# Altium schematic sheet CAN.SchDoc
size A3; SheetNumber: 3; SheetTotal: 5
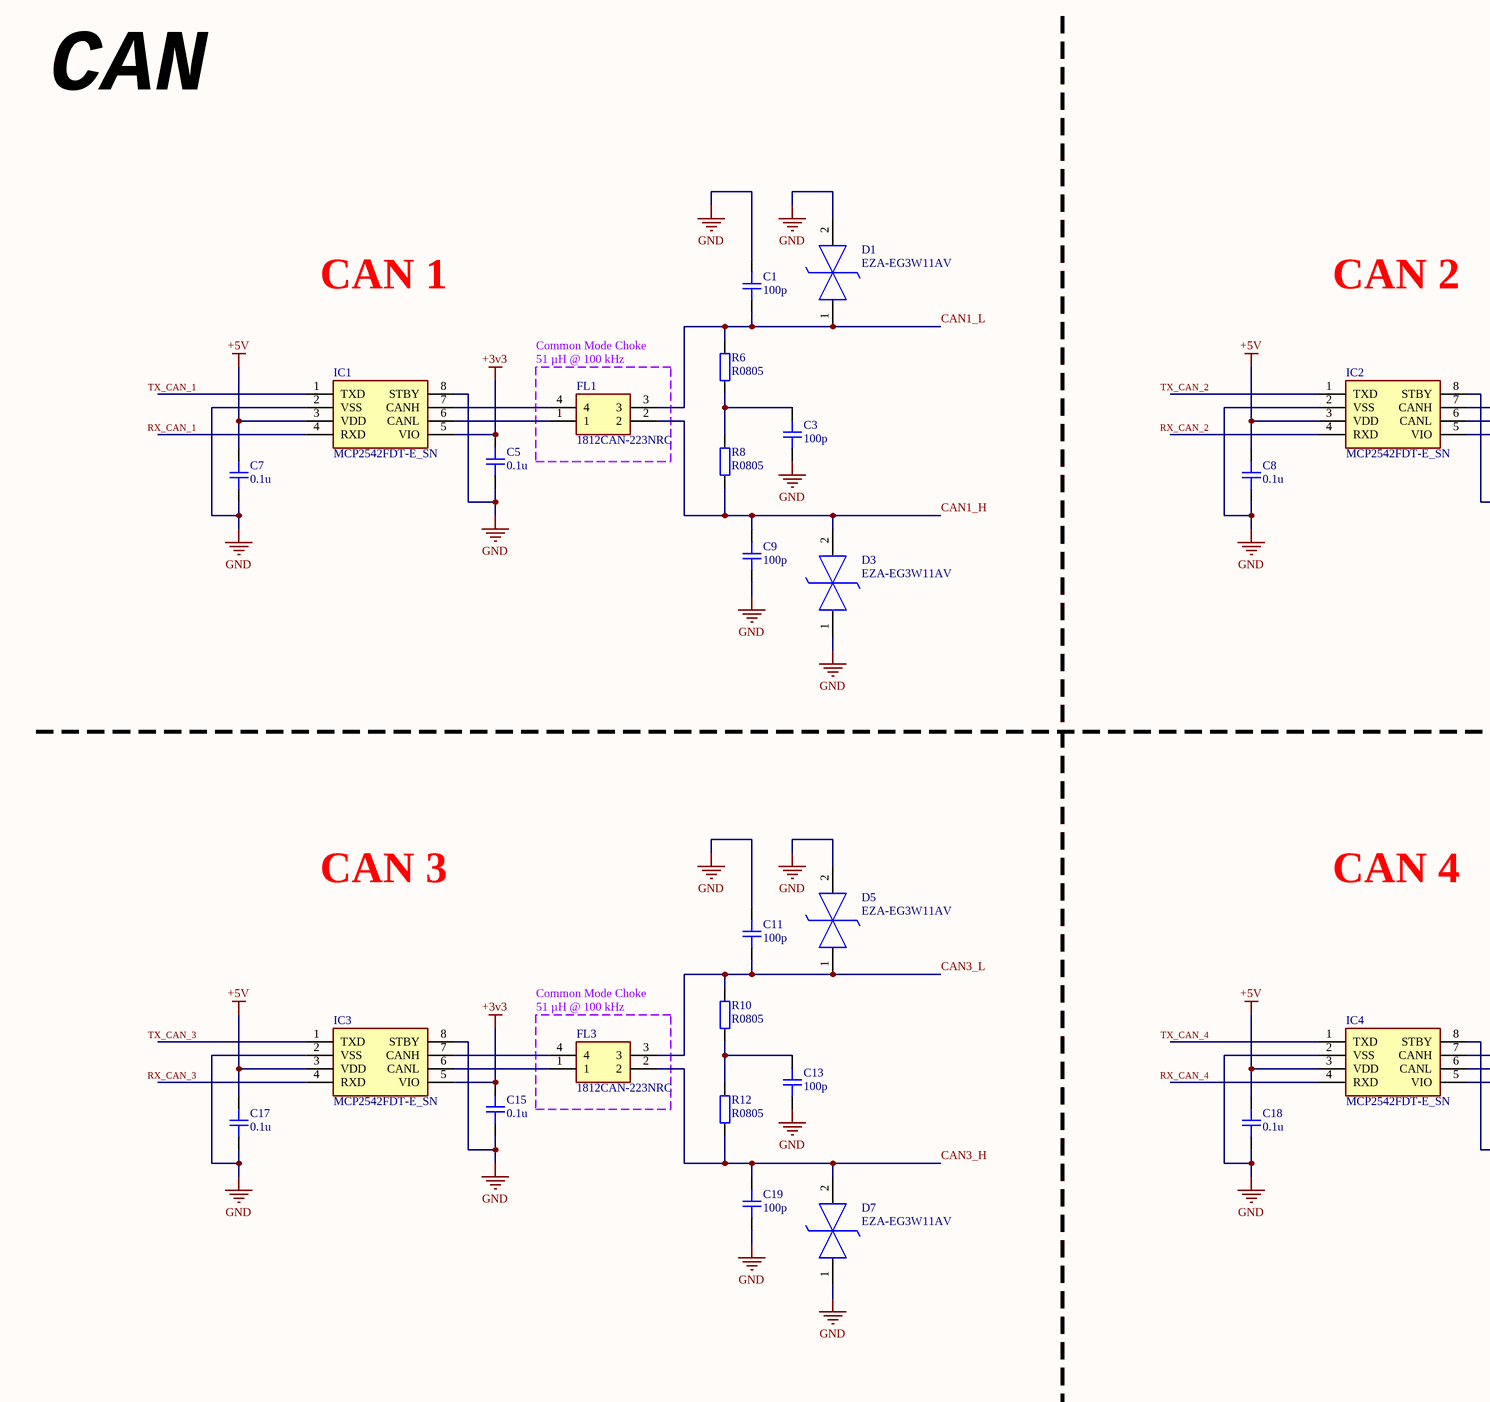
[diagram p0: CAN.SchDoc, left]
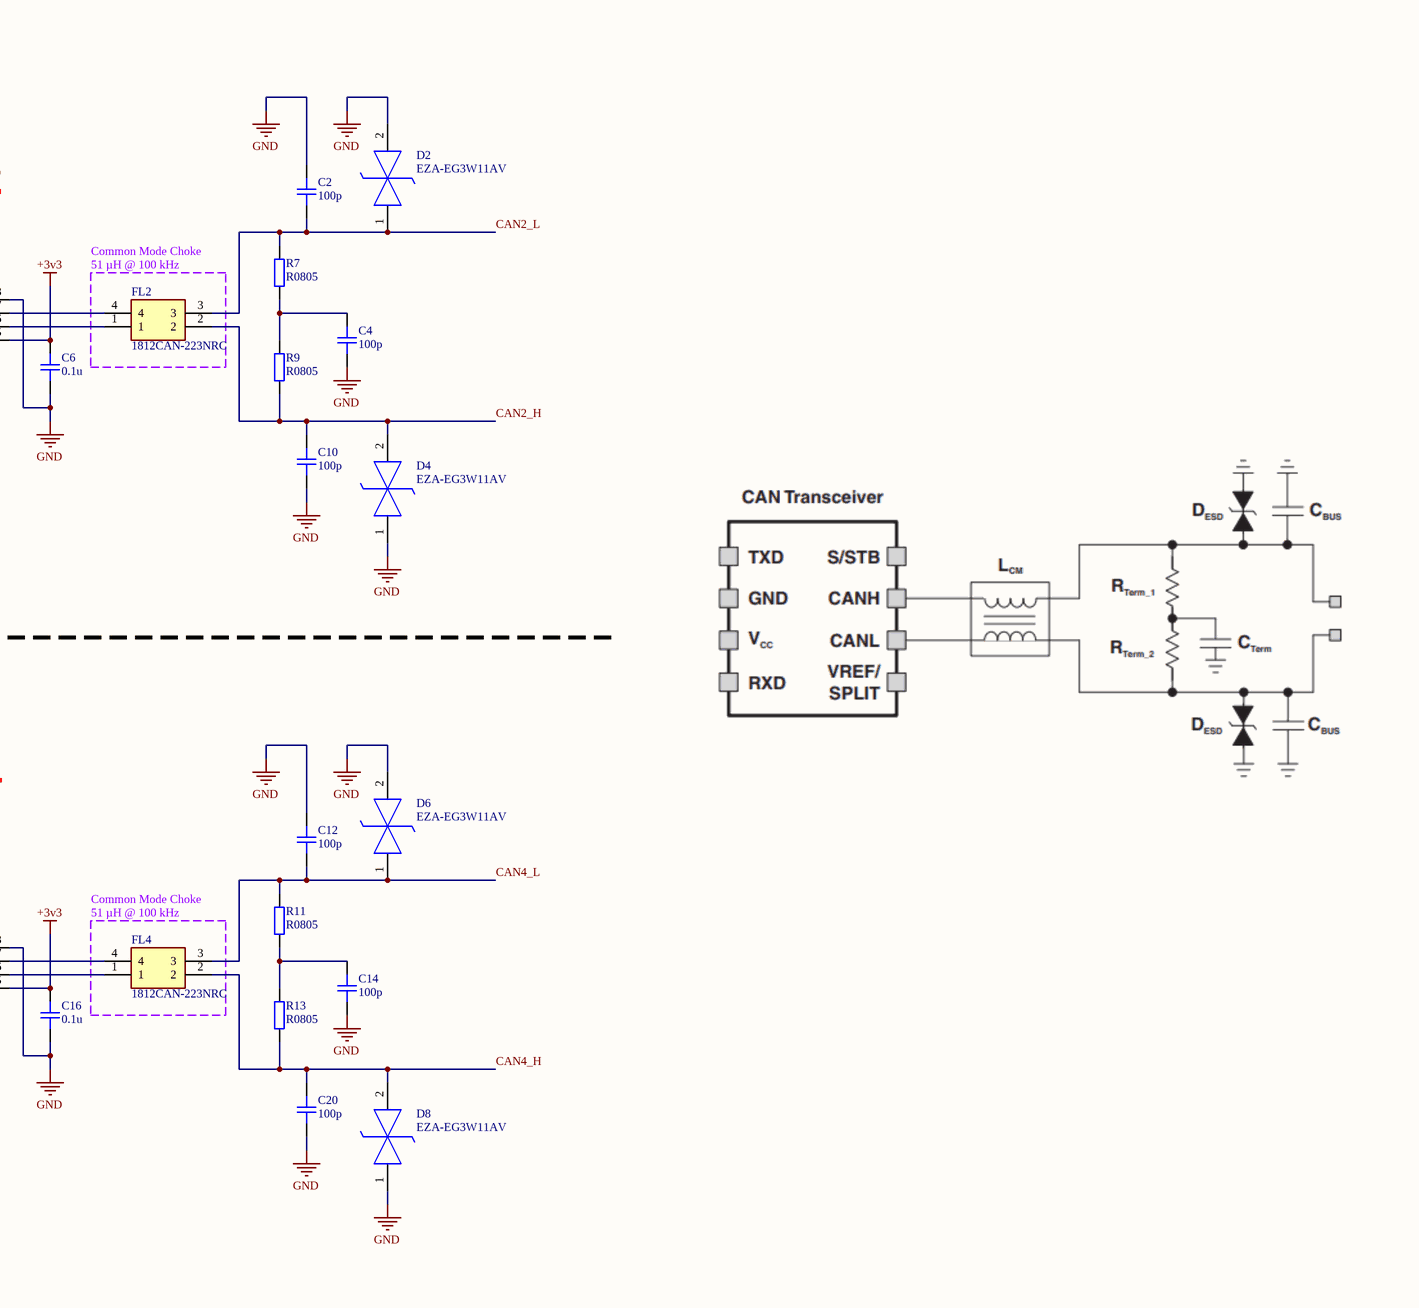
[diagram p1: CAN.SchDoc, right]

## Parts
C1  100p  [CAP_0805]
C2  100p  [CAP_0805]
C3  100p  [CAP_0805]
C4  100p  [CAP_0805]
C5  0.1u  [CAP_0805]
C6  0.1u  [CAP_0805]
C7  0.1u  [CAP_0805]
C8  0.1u  [CAP_0805]
C9  100p  [CAP_0805]
C10  100p  [CAP_0805]
C11  100p  [CAP_0805]
C12  100p  [CAP_0805]
C13  100p  [CAP_0805]
C14  100p  [CAP_0805]
C15  0.1u  [CAP_0805]
C16  0.1u  [CAP_0805]
C17  0.1u  [CAP_0805]
C18  0.1u  [CAP_0805]
C19  100p  [CAP_0805]
C20  100p  [CAP_0805]
D1  EZA-EG3W11AV  [EZAEG3W11AV]
D2  EZA-EG3W11AV  [EZAEG3W11AV]
D3  EZA-EG3W11AV  [EZAEG3W11AV]
D4  EZA-EG3W11AV  [EZAEG3W11AV]
D5  EZA-EG3W11AV  [EZAEG3W11AV]
D6  EZA-EG3W11AV  [EZAEG3W11AV]
D7  EZA-EG3W11AV  [EZAEG3W11AV]
D8  EZA-EG3W11AV  [EZAEG3W11AV]
FL1  1812CAN-223NRC  [1812CAN223NRC]
FL2  1812CAN-223NRC  [1812CAN223NRC]
FL3  1812CAN-223NRC  [1812CAN223NRC]
FL4  1812CAN-223NRC  [1812CAN223NRC]
IC1  MCP2542FDT-E_SN  [SOIC127P600X175-8N]
IC2  MCP2542FDT-E_SN  [SOIC127P600X175-8N]
IC3  MCP2542FDT-E_SN  [SOIC127P600X175-8N]
IC4  MCP2542FDT-E_SN  [SOIC127P600X175-8N]
R6  R0805  [RES_0805]
R7  R0805  [RES_0805]
R8  R0805  [RES_0805]
R9  R0805  [RES_0805]
R10  R0805  [RES_0805]
R11  R0805  [RES_0805]
R12  R0805  [RES_0805]
R13  R0805  [RES_0805]

## Nets
+3v3: C5.2 C6.2 C15.2 C16.2 IC1.5(VIO) IC2.5(VIO) IC3.5(VIO) IC4.5(VIO)
+5V: C7.2 C8.2 C17.2 C18.2 IC1.3(VDD) IC2.3(VDD) IC3.3(VDD) IC4.3(VDD)
GND: C1.1 C2.1 C3.2 C4.2 C5.1 C6.1 C7.1 C8.1 C9.2 C10.2 C11.1 C12.1 C13.2 C14.2 C15.1 C16.1 C17.1 C18.1 C19.2 C20.2 D1.2(K2) D2.2(K2) D3.1(K1) D4.1(K1) D5.2(K2) D6.2(K2) D7.1(K1) D8.1(K1) IC1.2(VSS) IC1.8(STBY) IC2.2(VSS) IC2.8(STBY) IC3.2(VSS) IC3.8(STBY) IC4.2(VSS) IC4.8(STBY)
CAN1_H: C9.1 D3.2(K2) FL1.2 R8.1
CAN1_L: C1.2 D1.1(K1) FL1.3 R6.2
CAN2_H: C10.1 D4.2(K2) FL2.2 R9.1
CAN2_L: C2.2 D2.1(K1) FL2.3 R7.2
CAN3_H: C19.1 D7.2(K2) FL3.2 R12.1
CAN3_L: C11.2 D5.1(K1) FL3.3 R10.2
CAN4_H: C20.1 D8.2(K2) FL4.2 R13.1
CAN4_L: C12.2 D6.1(K1) FL4.3 R11.2
RX_CAN_1: IC1.4(RXD)
RX_CAN_2: IC2.4(RXD)
RX_CAN_3: IC3.4(RXD)
RX_CAN_4: IC4.4(RXD)
TX_CAN_1: IC1.1(TXD)
TX_CAN_2: IC2.1(TXD)
TX_CAN_3: IC3.1(TXD)
TX_CAN_4: IC4.1(TXD)
NetC3_1: C3.1 R6.1 R8.2
NetC4_1: C4.1 R7.1 R9.2
NetC13_1: C13.1 R10.1 R12.2
NetC14_1: C14.1 R11.1 R13.2
NetFL1_1: FL1.1 IC1.6(CANL)
NetFL1_4: FL1.4 IC1.7(CANH)
NetFL2_1: FL2.1 IC2.6(CANL)
NetFL2_4: FL2.4 IC2.7(CANH)
NetFL3_1: FL3.1 IC3.6(CANL)
NetFL3_4: FL3.4 IC3.7(CANH)
NetFL4_1: FL4.1 IC4.6(CANL)
NetFL4_4: FL4.4 IC4.7(CANH)

## Notes on the sheet
- CAN
- CAN 1
- CAN 2
- (near FL1) Common Mode Choke
  51 µH @ 100 kHz
- (near FL2) Common Mode Choke
  51 µH @ 100 kHz
- CAN 3
- CAN 4
- (near FL3) Common Mode Choke
  51 µH @ 100 kHz
- (near FL4) Common Mode Choke
  51 µH @ 100 kHz

## Library data of the parts
C1-C20 = CAP_0805_10V: Capacitor SMD 0805 10V
D1-D8 = EZA-EG3W11AV: Diode ESD (Bi-directional); Manufacturer_Name: Panasonic; Datasheet Link: https://industrial.panasonic.com/cdbs/www-data/pdf/AWD0000/AWD0000C26.pdf; Height: 0.5mm; Manufacturer_Part_Number: EZA-EG3W11AV; Mouser Part Number: 667-EZA-EG3W11AV; Mouser Price/Stock: https://www.mouser.co.uk/ProductDetail/Panasonic/EZA-EG3W11AV?qs=0lSvoLzn4L%252BhlS%252B2lqbWqw%3D%3D; Arrow Part Number: EZA-EG3W11AV; Arrow Price/Stock: https://www.arrow.com/en/products/eza-eg3w11av/panasonic; Simulation Data: https://industrial.panasonic.com/content/data/CC/files/EZAEG3W11AV.zip
FL1-FL4 = 1812CAN-223NRC: Filter; Manufacturer_Name: COILCRAFT; Datasheet Link: https://www.coilcraft.com/getmedia/07970769-ca48-411d-9c96-6ae867bbb31e/1812can.pdf; Height: 3mm; Manufacturer_Part_Number: 1812CAN-223NRC; Mouser Part Number: 994-1812CAN-223NRC; Mouser Price/Stock: https://www.mouser.co.uk/ProductDetail/Coilcraft/1812CAN-223NRC?qs=wnTfsH77Xs58ULcmqHaGYA%3D%3D
IC1-IC4 = MCP2542FDT-E_SN: Integrated Circuit; Manufacturer_Name: Microchip; Manufacturer_Part_Number: MCP2542FDT-E/SN; Datasheet Link: https://ww1.microchip.com/downloads/en/DeviceDoc/MCP2542FD-MCP2542WFD-4WFD-Data-Sheet-DS20005514C.pdf; Height: 1.75mm; Mouser Part Number: 579-MCP2542FDT-E/SN; Mouser Price/Stock: https://www.mouser.co.uk/ProductDetail/Microchip-Technology-Atmel/MCP2542FDT-E-SN?qs=qdgZG5p0FZ7dgTYBMrlrQQ%3D%3D; Arrow Part Number: MCP2542FDT-E/SN; Arrow Price/Stock: https://www.arrow.com/en/products/mcp2542fdt-esn/microchip-technology?region=nac
R6-R13 = RES_0805: Resistor SMD 0805; Manufacturer: *; Manufacturer Part Number: *; Distributor Link: *; LCSC: *